# EAGLE design looter_round_molocs (EAGLE 9.6.2)
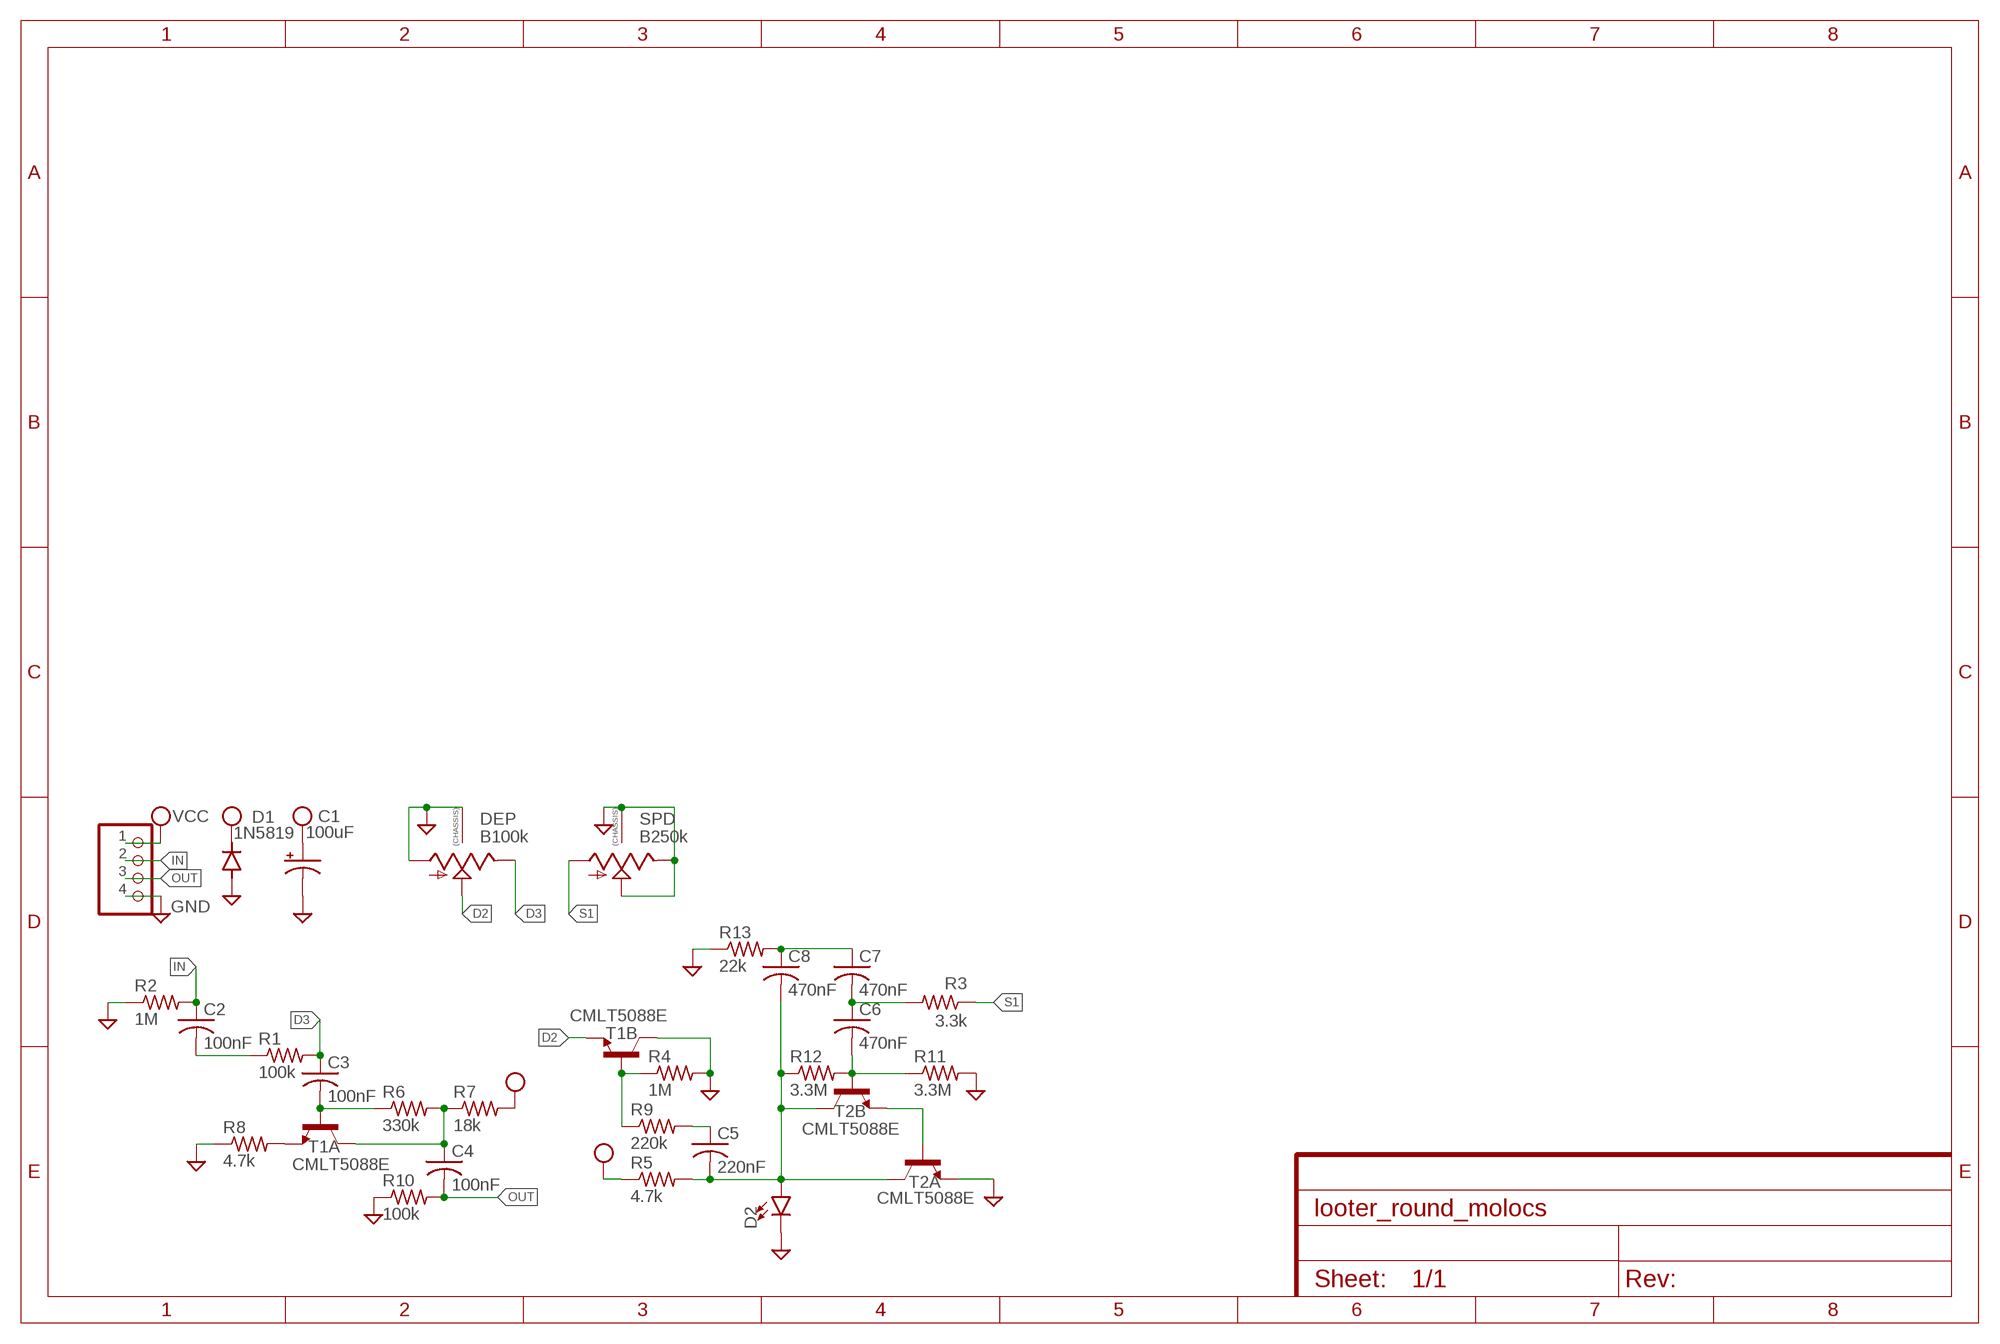
[diagram p0: schematic, sheet 1]

## Parts
C1  100uF  CAP_SMD+THRUPAN_B  [PAN_B_SMD+THRU]
C2  100nF  C-USC0603  [C0603]
C3  100nF  C-USC0603  [C0603]
C4  100nF  C-USC0603  [C0603]
C5  220nF  C-USC0603  [C0603]
C6  470nF  C-USC0603  [C0603]
C7  470nF  C-USC0603  [C0603]
C8  470nF  C-USC0603  [C0603]
D1  1N5819  DIODE-SOD123  [SOD123]
D2  LED0603  [LED-0603]
DEP  B100k  9MM_SNAP-IN_POT_CHASSIS  [9MM_SNAP-IN_POT]
JP1  PINHD-1X4  [1X04]
R1  100k  R-US_R0603  [R0603]
R2  1M  R-US_R0603  [R0603]
R3  3.3k  R-US_R0603  [R0603]
R4  1M  R-US_R0603  [R0603]
R5  4.7k  R-US_R0603  [R0603]
R6  330k  R-US_R0603  [R0603]
R7  18k  R-US_R0603  [R0603]
R8  4.7k  R-US_R0603  [R0603]
R9  220k  R-US_R0603  [R0603]
R10  100k  R-US_R0603  [R0603]
R11  3.3M  R-US_R0603  [R0603]
R12  3.3M  R-US_R0603  [R0603]
R13  22k  R-US_R0603  [R0603]
SPD  B250k  9MM_SNAP-IN_POT_CHASSIS  [9MM_SNAP-IN_POT]
T1  CMLT5088E  [SOT563]
T2  CMLT5088E  [SOT563]

## Nets
D2: DEP.2(S) T1.4(B:E)
D3: C3.1 DEP.3(E) R1.2
GND: C1.- C1.--(-) D1.A D2.C DEP.1(A) DEP.CHASSIS1 DEP.CHASSIS2 JP1.4 R2.1 R4.2 R8.1 R10.1 R11.2 R13.1 SPD.2(S) SPD.3(E) SPD.CHASSIS1 SPD.CHASSIS2 T1.3(B:C) T2.1(A:E)
IN: C2.1 JP1.2 R2.2
N$2: C2.2 R1.1
N$3: C3.2 R6.1 T1.2(A:B)
N$4: R8.2 T1.1(A:E)
N$5: C4.1 R6.2 R7.1 T1.6(A:C)
N$6: R4.1 R9.1 T1.5(B:B)
N$7: C5.1 R9.2
N$8: C5.2 C8.2 D2.A R5.2 R12.1 T2.3(B:C) T2.6(A:C)
N$9: T2.2(A:B) T2.4(B:E)
N$10: C6.2 R11.1 R12.2 T2.5(B:B)
N$11: C6.1 C7.2 R3.2
N$12: C7.1 C8.1 R13.2
OUT: C4.2 JP1.3 R10.2
S1: R3.1 SPD.1(A)
VCC: C1.+ C1.++(+) D1.C JP1.1 R5.1 R7.2

## Library data of the parts
C1 = MusicThingModular:CAP_SMD+THRU
C2-C8 = adafruit:C-US: CAPACITOR, American symbol
D1 = diode:DIODE-: DIODE
D2 = SparkFun-LED:LED: LED (Generic) Standard schematic elements and footprints for 5mm, 3mm, 1206, and 0603 sized LEDs. Generic LEDs with no color specified.
DEP SPD = MusicThingModular:9MM_SNAP-IN_POT_CHASSIS: 9mm vertical snap-in pot, Alpha / Panasonic style, with a connection to the metal chassis for grounding
JP1 = Connector:PINHD-1X4: PIN HEADER; CATEGORY: CONNECTOR; SUB-CATEGORY: PIN-HEADER
R1-R13 = adafruit:R-US_: RESISTOR, American symbol
T1 T2 = transistor:CMLT5088E: DUAL NPN/NPN L88 TRANSISTORS ENHANCED SPECIFICATION PICOmini(TM) SURFACE MOUNT Source: CMLT5078%20SERIES.pdf

## Board
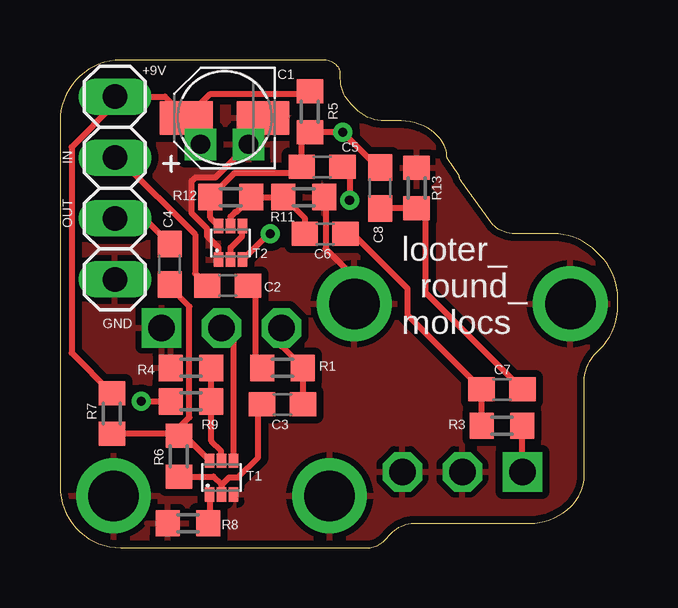
[diagram p1: board, top side]
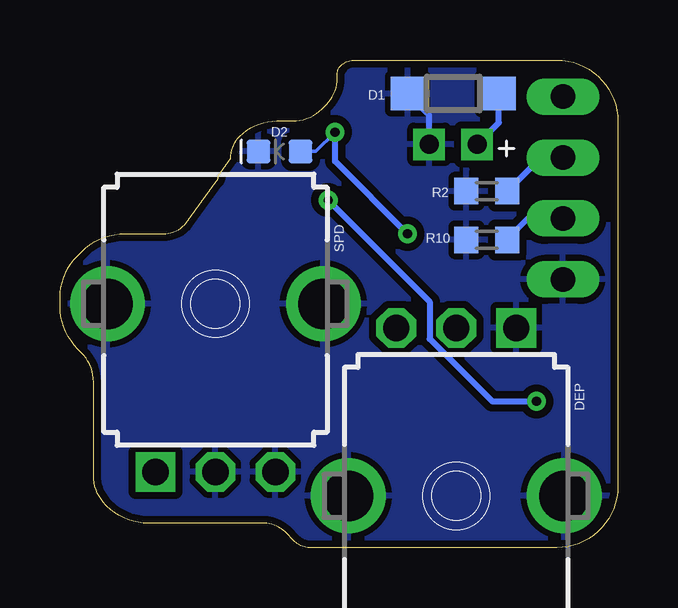
[diagram p2: board, bottom side, seen from below]

Size 23.24 x 20.32 mm. Coordinates in mm from the lower left corner, seen from the top.
Outline: 0,17.75 0,2.54 arc90 2.54,0 12.19,0 12.85,0 arc45 13.46,0.25 13.87,0.66 arc-45 14.73,1.02 19.56,1.02 arc45 21.29,1.73 21.34,1.78 arc45 21.84,3 21.84,6.9 arc-45 22.35,8.13 22.5,8.27 arc45 23.24,10.07 23.24,10.41 arc45 22.52,12.15 22.33,12.34 arc45 20.54,13.08 18.95,13.08 arc-45 18.03,13.46 16.73,15.28 arc-45 16.64,15.49 16.13,16.23 arc45 15.75,17.14 arc45 14.21,17.78 13.54,17.78 arc-45 12.32,18.29 12.13,18.47 arc-45 11.68,19.56 11.68,19.76 arc45 11.56,20.07 arc45 10.94,20.32 10.16,20.32 2.54,20.32 arc90 0,17.75
Copper layers (1*16): Top 0.035mm / dielectric 1.5mm / Bottom 0.035mm
Design rules "default *": minimum track width 6mil, minimum drill 0.35mm, track to track 6mil, track to pad 6mil, pad to pad 6mil, via to via 6mil, smd to smd 6mil, copper to edge 10mil, drill to drill 6mil, minimum pad ring 10mil, minimum via ring 8mil, stop-mask expansion 4mil, vias tented up to drill 0mil, thermal gap 10mil

### Footprints (pad centres in the part's own frame; a part is rotated, then mirrored left to right if it is on the bottom)
PAN_B_SMD+THRU = smd 2.2 x 1.4: + 1.6,0; - -1.6,0 | drill 0.8 pad 0.9 square: ++ 1,1.1; -- -1,1.1
C0603 = smd 1.1 x 1: 1 -0.85,0; 2 0.85,0
SOD123 = smd 1.4 x 1.4: A 1.9,0; C -1.9,0
LED-0603 = smd 1 x 1: A -0.877,0; C 0.877,0
9MM_SNAP-IN_POT = drill 1.1 square: 1 -2.5,-7 | drill 1.1 octagon: 2 0,-7; 3 2.5,-7 | drill 2.1 pad 2.794: CHASSIS1 -4.5,0; CHASSIS2 4.5,0
1X04 = drill 1.016 long: 1 -3.81,0; 2 -1.27,0; 3 1.27,0; 4 3.81,0
R0603 = smd 1 x 1.1: 1 -0.85,0; 2 0.85,0
SOT563 = smd 0.4 x 0.6: 1 -0.5,-0.7; 2 0,-0.7; 3 0.5,-0.7; 4 0.5,0.7; 5 0,0.7; 6 -0.5,0.7

### Placement (x,y rotation side)
C1  6.86,17.91 180 top
C2  6.99,10.92 0 top
C3  9.27,5.97 180 top
C4  4.57,11.81 90 top
C5  10.92,15.88 180 top
C6  11.05,13.08 180 top
C7  18.41,6.6 180 top
C8  13.34,14.99 90 top
D1  6.86,18.92 180 bottom
D2  14.1,16.51 180 bottom
DEP  6.73,2.16 180 bottom
JP1  2.29,14.99 270 top
R1  9.27,7.49 0 top
R2  5.46,14.86 0 bottom
R3  18.41,5.08 180 top
R4  5.46,7.49 180 top
R5  10.41,18.16 270 top
R6  4.95,3.81 90 top
R7  2.16,5.59 90 top
R8  5.33,1.02 0 top
R9  5.46,6.1 180 top
R10  5.46,12.83 0 bottom
R11  10.16,14.61 0 top
R12  7.11,14.61 0 top
R13  14.86,14.99 270 top
SPD  16.76,10.16 0 bottom
T1  6.73,2.92 0 top
T2  7.11,12.7 0 top

### Tracks (layer width: path | path; a pad name or v marks a point on that pad's centre or on a via)
D2
  Top 0.254: T1.4 7.23,8.66 DEP.2
D3
  Top 0.254: C3.1 R1.2 9.23,8.38 DEP.3
GND
  Top 0.254: C1.- 7.86,17.31 C1.-- 6.49,15.43 5.65,15.43 5.48,15.27 5.48,13.94 6.13,13.29 6.13,12.98 6.61,12.51 T2.1 | SPD.CHASSIS2 12.26,11.27 11.07,12.46 11.07,14.54 R11.2
  Bottom 0.254: C1.-- 7.86,18.02 D1.A
  pour Top (isolate 0.305): 10.16,20.32 2.54,20.32 arc90 0,17.78 0,2.54 arc90 2.54,0 11.65,0 arc45 13.44,0.74 arc-45 14.71,1.27 19.27,1.27 arc45 21.06,2.01 arc45 21.59,3.28 21.59,6.57 arc-45 22.33,8.36 22.5,8.53 arc45 23.24,10.32 23.24,11.27 arc45 22.5,13.06 22.33,13.23 arc45 20.54,13.97 18.83,13.97 arc-45 17.04,14.71 16.51,15.24 arc90 13.97,17.78 13.75,17.78 arc-45 11.96,18.52 11.43,19.05 arc90
  pour Bottom (isolate 0.305): 10.16,20.32 2.54,20.32 arc90 0,17.78 0,2.54 arc90 2.54,0 11.65,0 arc45 13.44,0.74 arc-45 14.71,1.27 19.27,1.27 arc45 21.06,2.01 arc45 21.59,3.28 21.59,6.57 arc-45 22.33,8.36 22.5,8.53 arc45 23.24,10.32 23.24,11.27 arc45 22.5,13.06 22.33,13.23 arc45 20.54,13.97 18.83,13.97 arc-45 17.04,14.71 16.51,15.24 arc90 13.97,17.78 13.75,17.78 arc-45 11.96,18.52 11.43,19.05 arc90
IN
  Top 0.254: JP1.2 2.38,16.16 2.52,16.16 5.63,13.05 5.63,11.43 C2.1
  Bottom 0.254: R2.2 3.21,16.26 JP1.2
N$2
  Top 0.254: C2.2 8.13,10.63 8.13,7.79 R1.1
N$3
  Top 0.254: R6.1 6.39,2.96 6.71,2.64 6.71,2.24 T1.2 6.75,2.24 6.75,2.64 7.04,2.93 7.43,2.93 8.26,3.75 8.26,5.8 C3.2
N$4
  Top 0.254: T1.1 6.23,1.06 R8.2
N$5
  Top 0.254: R6.2 4.95,4.99 5.39,5.43 5.39,10.04 4.57,10.86 C4.1 | R6.2 4.88,4.74 R7.1 | T1.6 5.19,4.66 R6.2
N$6
  Top 0.254: T1.5 6.71,3.64 6.71,4.04 6.31,4.44 R9.1 R4.1
N$7  (via drill 0.38)
  Top 0.254: C5.1 12.06,15.58 v12.06,14.48 | v3.38,6.1 R9.2
  Bottom 0.254: v12.06,14.48 7.83,10.25 7.83,8.7 5.23,6.1 v3.38,6.1
N$8  (via drill 0.38)
  Top 0.254: T2.6 6.26,13.75 R12.1 7.28,15.62 9.82,15.62 C5.2 10.07,16.97 R5.2 v11.78,17.31 13.26,15.84 C8.2 | T2.3 8.69,13.08 v8.76,13.08
  Bottom 0.152: v11.78,17.31 12.58,16.51 D2.A
  Bottom 0.254: v8.76,13.08 11.78,16.1 v11.78,17.31
N$9
  Top 0.254: T2.4 7.59,13.38 7.59,12.98 7.11,12.51 T2.2
N$10
  Top 0.254: T2.5 7.11,13.79 7.3,13.98 7.34,13.98 R12.2 R11.1 10.2,13.72 C6.2
N$11
  Top 0.254: R3.2 C7.2 14.48,9.69 14.48,10.79 12.2,13.08 C6.1
N$12
  Top 0.254: C7.1 15.24,10.63 15.24,13.76 R13.2 C8.1
OUT
  Top 0.254: JP1.3 3.52,13.72 C4.2
  Bottom 0.254: JP1.3 3.72,13.72 R10.2
S1
  Top 0.254: SPD.1 R3.1
VCC
  Top 0.254: C1.+ 4.37,18.8 JP1.1 2.29,18.49 0.48,16.69 0.48,8.11 R7.2 | C1.+ 5.86,17.31 C1.++ | R5.1 10.29,18.89 6.24,18.89 C1.+
  Bottom 0.254: C1.++ 4.96,17.71 D1.C

### Text on the board
tPlace: +9V | IN | OUT | looter_ | round_ | GND | molocs